# Altium schematic sheet Safety Loops.SchDoc
size A3 portrait
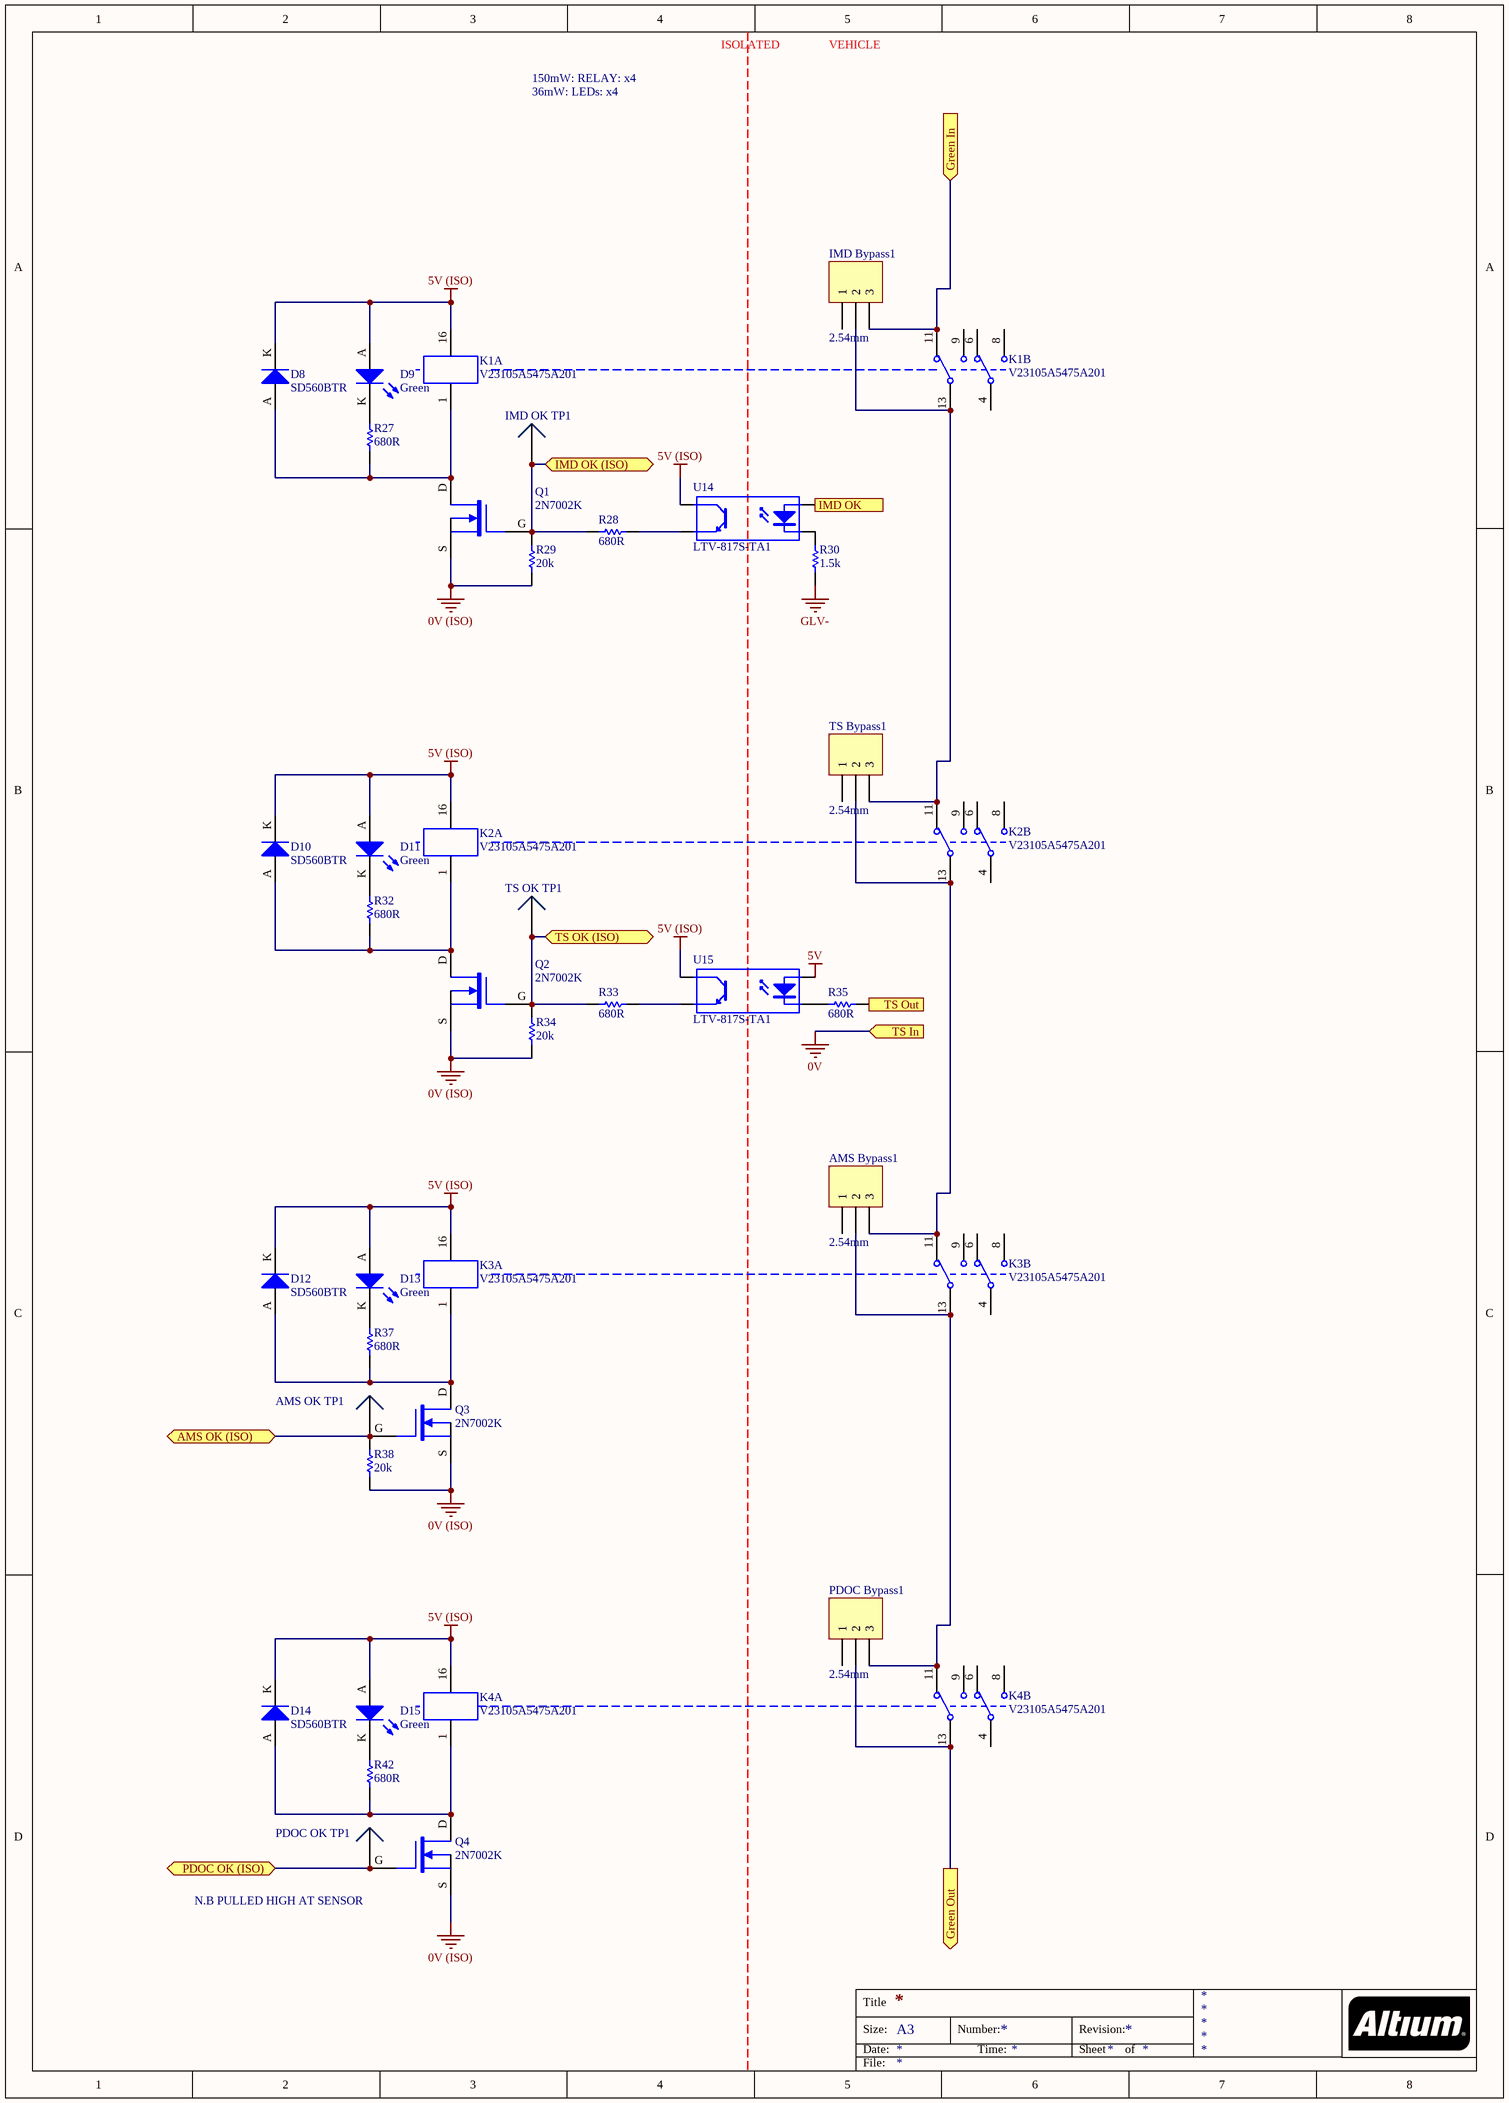
[diagram p0: Safety Loops.SchDoc]

## Parts
AMS_Bypass1  2.54mm  [TH 2.54mm Header 1x3]
AMS_OK_TP1  0mm  [SMD Test Point]  (value not drawn)
D8  SD560BTR  [SMB Diode]
D9  Green  [0805 LED]
D10  SD560BTR  [SMB Diode]
D11  Green  [0805 LED]
D12  SD560BTR  [SMB Diode]
D13  Green  [0805 LED]
D14  SD560BTR  [SMB Diode]
D15  Green  [0805 LED]
IMD_Bypass1  2.54mm  [TH 2.54mm Header 1x3]
IMD_OK_TP1  0mm  [SMD Test Point]  (value not drawn)
K1  V23105A5475A201  [TI 2-DIL]  (parts A,B of 2)
K2  V23105A5475A201  [TI 2-DIL]  (parts A,B of 2)
K3  V23105A5475A201  [TI 2-DIL]  (parts A,B of 2)
K4  V23105A5475A201  [TI 2-DIL]  (parts A,B of 2)
PDOC_Bypass1  2.54mm  [TH 2.54mm Header 1x3]
PDOC_OK_TP1  0mm  [SMD Test Point]  (value not drawn)
Q1  2N7002K  [SOT-343_N]
Q2  2N7002K  [SOT-343_N]
Q3  2N7002K  [SOT-343_N]
Q4  2N7002K  [SOT-343_N]
R27  680R  [0805]
R28  680R  [0805]
R29  20k  [0805]
R30  1.5k  [0805]
R32  680R  [0805]
R33  680R  [0805]
R34  20k  [0805]
R35  680R  [0805]
R37  680R  [0805]
R38  20k  [0805]
R42  680R  [0805]
TS_Bypass1  2.54mm  [TH 2.54mm Header 1x3]
TS_OK_TP1  0mm  [SMD Test Point]  (value not drawn)
U14  LTV-817S-TA1  [ON 4-SMD]
U15  LTV-817S-TA1  [ON 4-SMD]

## Ports
AMS OK (ISO) (bidir), Green In (in), Green Out (out), IMD OK, IMD OK (ISO) (bidir), PDOC OK (ISO) (bidir), TS In (in), TS OK (ISO) (bidir), TS Out (out)

## Nets
0V: port TS In
0V (ISO): Q1.S Q2.S Q3.S Q4.S R29.1 R34.1 R38.1
5V: U15.1(A)
5V (ISO): D8.K D9.A D10.K D11.A D12.K D13.A D14.K D15.A K1.16 K2.16 K3.16 K4.16 U14.4(C) U15.4(C)
GLV-: R30.1
AMS OK (ISO): AMS_OK_TP1.1 Q3.G R38.2 ; port AMS OK (ISO)
Green In: IMD_Bypass1.3 K1.11 ; port Green In
Green Out: K4.13 PDOC_Bypass1.2 ; port Green Out
IMD OK: U14.1(A) ; port IMD OK
IMD OK (ISO): IMD_OK_TP1.1 Q1.G R28.1 R29.2 ; port IMD OK (ISO)
PDOC OK (ISO): PDOC_OK_TP1.1 Q4.G ; port PDOC OK (ISO)
TS OK (ISO): Q2.G R33.1 R34.2 TS_OK_TP1.1 ; port TS OK (ISO)
TS Out: R35.2 ; port TS Out
NetAMS_Bypass1_2: AMS_Bypass1.2 K3.13 K4.11 PDOC_Bypass1.3
NetAMS_Bypass1_3: AMS_Bypass1.3 K2.13 K3.11 TS_Bypass1.2
NetD8_A: D8.A K1.1 Q1.D R27.1
NetD9_K: D9.K R27.2
NetD10_A: D10.A K2.1 Q2.D R32.1
NetD11_K: D11.K R32.2
NetD12_A: D12.A K3.1 Q3.D R37.1
NetD13_K: D13.K R37.2
NetD14_A: D14.A K4.1 Q4.D R42.1
NetD15_K: D15.K R42.2
NetIMD_Bypass1_2: IMD_Bypass1.2 K1.13 K2.11 TS_Bypass1.3
NetR28_2: R28.2 U14.3(E)
NetR30_2: R30.2 U14.2(K)
NetR33_2: R33.2 U15.3(E)
NetR35_1: R35.1 U15.2(K)

Not connected (* = marked no-connect by the designer): AMS_Bypass1 1; IMD_Bypass1 1; K1 4 6 8 9; K2 4 6 8 9; K3 4 6 8 9; K4 4 6 8 9; PDOC_Bypass1 1; TS_Bypass1 1

## Notes on the sheet
- 150mW: RELAY: x4
- 36mW: LEDs: x4
- ISOLATED
- VEHICLE
- N.B PULLED HIGH AT SENSOR
- Title
- Size:
- Date:
- A3
- Number:
- Time:
- Revision:
- Sheet
- of
- File:

## Library data of the parts
AMS_Bypass1 IMD_Bypass1 PDOC_Bypass1 TS_Bypass1 = TH 2.54mm Header 1x3: Positions: 3; Angle: 0; Flange: No; Contact: NA; Part Number: TH 2.54mm Header 1x3; Pitch: 2.54mm; Row Spacing: 2.54mm
AMS_OK_TP1 IMD_OK_TP1 PDOC_OK_TP1 TS_OK_TP1 = SMD Test Point: Positions: 1; Row Spacing: 0; Flange: No; Contact: NA; Part Number: SMD Test Point; Pitch: 0mm; Angle: 0
D8 D10 D12 D14 = SD560BTR: 1.2V_F 600V 5A SMB; Manufacturer: SMC Diode Solutions; Part Number: SD560BTR; Digikey Part Number: 1655-1530-2-ND; Digikey Link: https://www.digikey.com/product-detail/en/smc-diode-solutions/SD560BTR/1655-1530-2-ND/6022620
D9 D11 D13 D15 = SML-210FTT86: Green LED Indication - Discrete 1.75V 0805 (2012 Metric); Manufacturer: ROHM Semiconductor; Part Number: SML-210FTT86; Colour: Green; Digikey Part Number: 511-1285-1-ND; Digikey Link: https://www.digikey.com/product-detail/en/rohm-semiconductor/SML-210FTT86/511-1285-1-ND/637098
K1-K4 = V23105A5475A201: 5V DPDT Relay 3A 220VDC; Manufacturer: Axicom; Part Number: V23105A5475A201; Digikey Part Number: PB383-ND; Digikey Link: https://www.digikey.com/products/en?mpart=V23105A5001A201&v=41
Q1-Q4 = 2N7002K: 60V 380mA, NFET MOSTFET (Small Signal); Manufacturer: ON Semiconductor; Published: 24-Mar-1999; LatestRevisionDate: 29-May-2009; LatestRevisionNote: IPC-7351 Footprint Added.; PackageVersion: Sep-2000; PackageReference: SOT-343; Publisher: Altium Limited; PackageDescription: 4-Pin SOT-343 Package 1.3 mm Pitch, 2.1 mm Lead Span; Part Number: 2N7002K; Digikey Part Number: 2N7002KCT-ND; Digikey Link: https://www.digikey.com/product-detail/en/on-semiconductor/2N7002K/2N7002KCT-ND/2060375; Qty: 30
R27 R28 R32 R33 R35 R37 R42 = RC0805FR07680RL: Manufacturer: YAGEO; Tolerance: 0.01; Rated Voltage: 0.125W; Part Number: RC0805FR07680RL; Value: 680R; Material: FR-07
R29 R34 R38 = RC0805FR0720KL: Manufacturer: YAGEO; Tolerance: 0.01; Rated Voltage: 0.125W; Part Number: RC0805FR0720KL; Value: 20k; Material: FR-07
R30 = RC0805FR071K5L: Manufacturer: YAGEO; Tolerance: 0.01; Rated Voltage: 0.125W; Part Number: RC0805FR071K5L; Value: 1.5k; Material: FR-07
U14 U15 = LTV-817S-TA1: 35V 50ma Optocoupler (VF=1.2V); Manufacturer: Lite-On Inc; Part Number: LTV-817S-TA1; Digikey Part Number: 160-1893-2-ND; Digikey Link: https://www.digikey.com/product-detail/en/lite-on-inc/LTV-817S-TA1/160-1893-2-ND/388451